# Altium schematic sheet Connector.SchDoc
size A; SheetNumber: 6; SheetTotal: 15
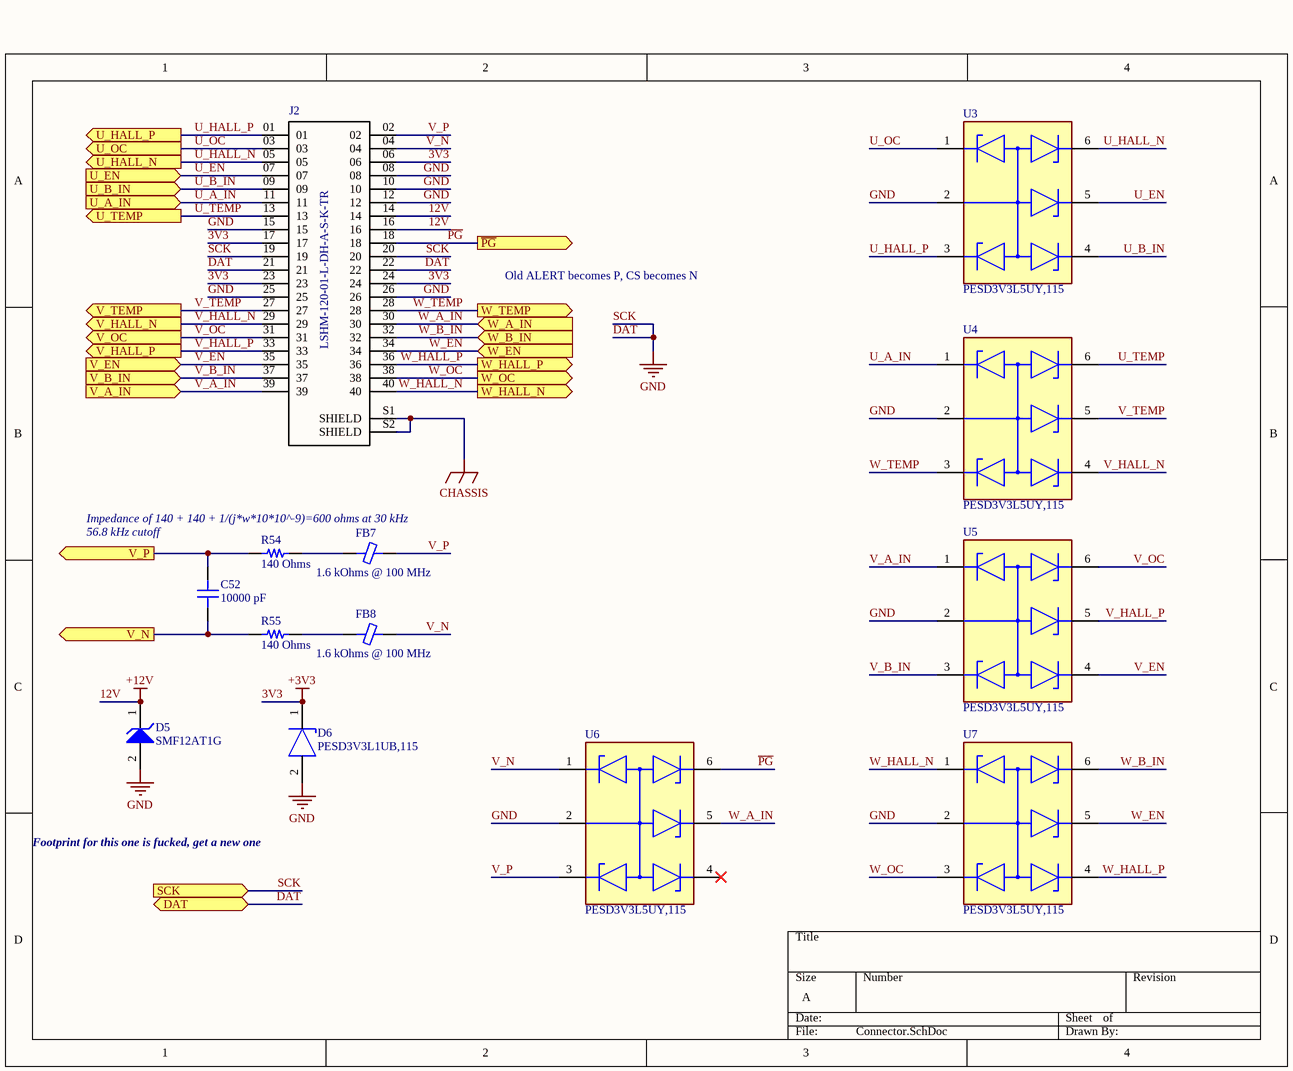
[diagram p0: Connector.SchDoc]

## Parts
C52  10000 pF  [CAP 0402_1005]
D5  SMF12AT1G  [ONSC-SOD-123FL-2-498_V]
D6  PESD3V3L1UB,115  [FP-SOD523-MFG]
FB7  1.6 kOhms @ 100 MHz  [FER 0603_1608]
FB8  1.6 kOhms @ 100 MHz  [FER 0603_1608]
J2  LSHM-120-01-L-DH-A-S-K-TR  [*SAMTEC_LSHM-120-01-L-DH-A-S-K-TR_LSHM-120-01-L-DH-A-S-K-TR(Primary)]
R54  140 Ohms  [RES 0402_1005]
R55  140 Ohms  [RES 0402_1005]
U3  PESD3V3L5UY,115  [FP-SOT363-IPC_A]
U4  PESD3V3L5UY,115  [FP-SOT363-IPC_A]
U5  PESD3V3L5UY,115  [FP-SOT363-IPC_A]
U6  PESD3V3L5UY,115  [FP-SOT363-IPC_A]
U7  PESD3V3L5UY,115  [FP-SOT363-IPC_A]

## Ports
DAT (bidir), SCK (in), U_A_IN (in), U_B_IN (in), U_EN (in), U_HALL_N (out), U_HALL_P (out), U_OC (out), U_TEMP (out), V_A_IN (in), V_B_IN (in), V_EN (in), V_HALL_N (out), V_HALL_P (out), V_N (out), V_OC (out), V_P (out), V_TEMP (out), W_A_IN (in), W_B_IN (in), W_EN (in), W_HALL_N (out), W_HALL_P (out), W_OC (out), W_TEMP (out), ~{PG} (out)

## Nets
3V3: D6.1(C) J2.06 J2.17 J2.23 J2.24  [also labelled +3V3]
12V: D5.1(K) J2.14 J2.16  [also labelled +12V]
CHASSIS: J2.S1(SHIELD) J2.S2(SHIELD)
DAT: D5.2(A) D6.2(A) J2.08 J2.10 J2.12 J2.15 J2.19 J2.20 J2.21 J2.22 J2.25 J2.26 U3.2(COMMON_ANODE) U4.2(COMMON_ANODE) U5.2(COMMON_ANODE) U6.2(COMMON_ANODE) U7.2(COMMON_ANODE) ; port SCK, port DAT  [also labelled GND, SCK]
~{PG}: J2.18 U6.6(CATHODE(DIODE_5)) ; port ~{PG}
U_A_IN: J2.11 U4.1(CATHODE(DIODE_1)) ; port U_A_IN
U_B_IN: J2.09 U3.4(CATHODE(DIODE_3)) ; port U_B_IN
U_EN: J2.07 U3.5(CATHODE(DIODE_4)) ; port U_EN
U_HALL_N: J2.05 U3.6(CATHODE(DIODE_5)) ; port U_HALL_N
U_HALL_P: J2.01 U3.3(CATHODE(DIODE_2)) ; port U_HALL_P
U_OC: J2.03 U3.1(CATHODE(DIODE_1)) ; port U_OC
U_TEMP: J2.13 U4.6(CATHODE(DIODE_5)) ; port U_TEMP
V_A_IN: J2.39 U5.1(CATHODE(DIODE_1)) ; port V_A_IN
V_B_IN: J2.37 U5.3(CATHODE(DIODE_2)) ; port V_B_IN
V_EN: J2.35 U5.4(CATHODE(DIODE_3)) ; port V_EN
V_HALL_N: J2.29 U4.4(CATHODE(DIODE_3)) ; port V_HALL_N
V_HALL_P: J2.33 U5.5(CATHODE(DIODE_4)) ; port V_HALL_P
V_N: FB8.2 J2.04 U6.1(CATHODE(DIODE_1))
V_N: C52.1 R55.1 ; port V_N  [a separate net that carries the same name]
V_OC: J2.31 U5.6(CATHODE(DIODE_5)) ; port V_OC
V_P: FB7.2 J2.02 U6.3(CATHODE(DIODE_2))
V_P: C52.2 R54.1 ; port V_P  [a separate net that carries the same name]
V_TEMP: J2.27 U4.5(CATHODE(DIODE_4)) ; port V_TEMP
W_A_IN: J2.30 U6.5(CATHODE(DIODE_4)) ; port W_A_IN
W_B_IN: J2.32 U7.6(CATHODE(DIODE_5)) ; port W_B_IN
W_EN: J2.34 U7.5(CATHODE(DIODE_4)) ; port W_EN
W_HALL_N: J2.40 U7.1(CATHODE(DIODE_1)) ; port W_HALL_N
W_HALL_P: J2.36 U7.4(CATHODE(DIODE_3)) ; port W_HALL_P
W_OC: J2.38 U7.3(CATHODE(DIODE_2)) ; port W_OC
W_TEMP: J2.28 U4.3(CATHODE(DIODE_2)) ; port W_TEMP
NetFB7_1: FB7.1 R54.2
NetFB8_1: FB8.1 R55.2

Not connected (* = marked no-connect by the designer): U6 4(CATHODE(DIODE_3))*

## Notes on the sheet
- Old ALERT becomes P, CS becomes N
- (near C52) 56.8 kHz cutoff
- Impedance of 140 + 140 + 1/(j*w*10*10^-9)=600 ohms at 30 kHz
- Footprint for this one is fucked, get a new one

## Library data of the parts
C52 = C0402C103J5RECAUTO: CAP CER 0402 10NF 50V X7R 5%; manufacturer: KEMET; Part Number: C0402C103J5RECAUTO; Capacitance: 10000 pF; Applications: Automotive, ESD Protection; componentlink1description: Datasheet; componentlink1url: https://api.kemet.com/component-edge/download/datasheet/C0402C103J5RECAUTO.pdf; componentlink2description: DigiKey Link; componentlink2url: https://www.digikey.com/en/products/detail/kemet/C0402C103J5RECAUTO/8646448; Device Package: 0402 (1005 Metric); lastupdated: 2/9/2024 8:04:13 PM; Lifecycle Status: Active; Minimum Order: 1; Mounting Type: Surface Mount, MLCC; Operating Temperature: -55°C ~ 125°C; Package / Case: 0402 (1005 Metric); packaging: TapeAndReel; partid: 33153; Part Status: Active; price: 0.02; Ratings: AEC-Q200; series: ESD SMD Auto X7R; Size / Dimension: 0.039" L x 0.020" W (1.00mm x 0.50mm); Supplier 1: DigiKey; Supplier Part Number 1: 399-C0402C103J5RECAUTOCT-ND; Temperature Coefficient: X7R; Thickness (Max): 0.022" (0.55mm); Tolerance: ±5%; value: 10000 pF; Voltage - Rated: 50V
D5 = CMP-1061-00626-1: 200 W Transient Voltage Suppressor, 2-Pin SOD-123FL, Pb-Free, Tape and Reel; Manufacturer: On Semiconductor; Direction: Unidirectional; V(BR) Typ (V): 14; IR Max (uA): 2.5; PackageDescription: 2-Pin SOD, Body 1.65 x 2.7 mm; ComponentLink2URL: http://www.onsemi.com/pub_link/Collateral/SMF5.0AT1-D.PDF; DatasheetVersion: Rev. 7; PartNumber: SMF12AT1G; ComponentLink1Description: Manufacturer URL; ComponentLink2Description: Datasheet; ComponentLink1URL: http://www.onsemi.com/; ComponentLink3Description: Package Specification; Mounting Technology: Surface Mount; PackageReference: SOD-123FL-2-498; RoHS: Pb-Free; PackageVersion: Rev. D, 05/2013; Packing: Tape and Reel; ComponentLink3URL: http://www.onsemi.com/pub_link/Collateral/498-01.PDF
D6 = CMP-14432-000009-1: TVS DIODE 3.3VWM 11VC SOD523; RoHS Compliant: Yes
FB7 FB8 = MHF1608BAC352ATD25: FERRITE BEAD 1.6K OHM 0603 1LN; Manufacturer: TDK Corporation; Current Rating (Max): 170mA; DC Resistance (DCR) (Max): 1.8Ohm; Number of Lines: 1; Part Number: MHF1608BAC352ATD25; ComponentLink1Description: Datasheet; ComponentLink1URL: https://media.digikey.com/pdf/Data%20Sheets/TDK%20PDFs/MHF1608_Type_DS.pdf; ComponentLink2Description: DigiKey Link; ComponentLink2URL: https://www.digikey.com/en/products/detail/tdk-corporation/MHF1608BAC352ATD25/12702586; Device Package: 0603 (1608 Metric); Height (Max): 0.037" (0.95mm); Impedance @ Frequency: 1.6 kOhms @ 100 MHz; LastUpdated: 6/3/2024 7:51:46 PM; Lifecycle Status: Active; Minimum Order: 1; Mounting Type: Surface Mount; Operating Temperature: -55°C ~ 125°C; Package / Case: 0603 (1608 Metric); Packaging: TapeAndReel; PartId: 2238; Part Status: Active; Price: 0.05; Ratings: AEC-Q200; Series: MHF; Size / Dimension: 0.063" L x 0.031" W (1.60mm x 0.80mm); Supplier 1: DigiKey; Supplier Part Number 1: 445-MHF1608BAC352ATD25CT-ND; Value: 1.6 kOhms @ 100 MHz
R54 R55 = RQ73C1E140RBTD: RES 140 OHMS 0.1% 1/16W 0402; Manufacturer: TE Connectivity Passive Product; Power (Watts): 0.063W, 1/16W; Temperature Coefficient: ±10ppm/°C; Part Number: RQ73C1E140RBTD; Value: 140 Ohms; ComponentLink1Description: Datasheet; ComponentLink1URL: //media.digikey.com/pdf/Data%20Sheets/Tyco%20Electronics%20P%20B%20PDFs/RQ73-0618%20v2.pdf; ComponentLink2Description: DigiKey Link; ComponentLink2URL: https://www.digikey.com/en/products/detail/te-connectivity-passive-product/RQ73C1E140RBTD/9480200; Composition: Thin Film; Device Package: 0402 (1005 Metric); Features: Anti-Sulfur, Automotive AEC-Q200; Height - Seated (Max): 0.016" (0.40mm); LastUpdated: 2/9/2024 8:30:21 PM; Lifecycle Status: Active; Minimum Order: 1; Number of Terminations: 2; Operating Temperature: -55°C ~ 155°C; Package / Case: 0402 (1005 Metric); Packaging: TapeAndReel; PartId: 3032; Part Status: Active; Price: 0.27; Ratings: AEC-Q200; Resistance: 140 Ohms; Series: RQ73; Size / Dimension: 0.039" L x 0.020" W (1.00mm x 0.50mm); Supplier 1: DigiKey; Supplier Part Number 1: A140252CT-ND; Supplier Device Package: 0402; Tolerance: ±0.1%
U3-U7 = CMP-14432-000006-1: TVS DIODE 3.3VWM 12VC 6TSSOP; RoHS Compliant: Yes
J2 = LSHM-120-01-L-DH-A-S-K-TR: Value: *